# Altium schematic sheet STM8S_RF433_RELAY_LEARN_CODE_V1.SchDoc
size A4; SheetNumber: 1; SheetTotal: 1
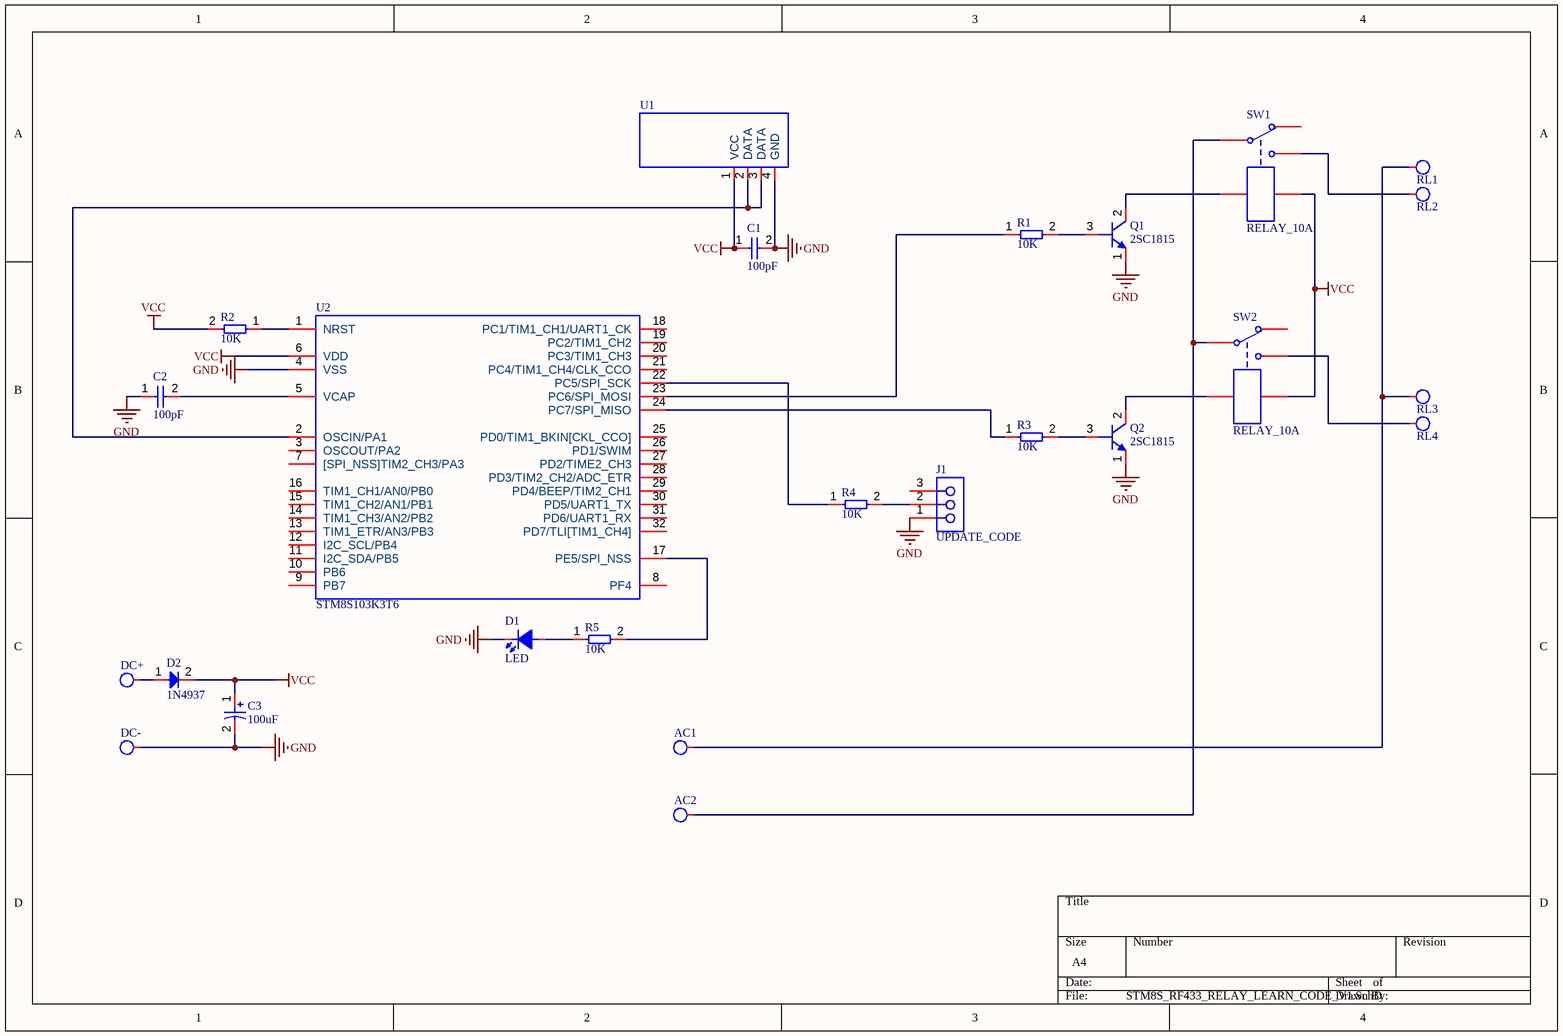
[diagram p0: STM8S_RF433_RELAY_LEARN_CODE_V1.SchDoc]

## Parts
AC1  SolderPoint  [SolderPoint]  (value not drawn)
AC2  SolderPoint  [SolderPoint]  (value not drawn)
C1  100pF  [CAP_Ceramic_Disc_2]
C2  100pF  [CAP_Ceramic_Disc_2]
C3  100uF  [CAP_RAD_2.5mm]
D1  LED  [LED_3MM_GREEN]
D2  1N4937  [DO-41]
DC+  SolderPoint  [SolderPoint]  (value not drawn)
DC-  SolderPoint  [SolderPoint]  (value not drawn)
J1  UPDATE_CODE  [Header 3x1 TH Pitch 2.54mm]
Q1  2SC1815  [TO-92]
Q2  2SC1815  [TO-92]
R1  10K  [RES-0.25W-H-MF]
R2  10K  [RES-0.25W-H-MF]
R3  10K  [RES-0.25W-H-MF]
R4  10K  [RES-0.25W-H-MF]
R5  10K  [RES-0.25W-H-MF]
RL1  AC  [SolderPoint]  (value not drawn)
RL2  AC  [SolderPoint]  (value not drawn)
RL3  AC  [SolderPoint]  (value not drawn)
RL4  AC  [SolderPoint]  (value not drawn)
SW1  RELAY_10A  [RELAY_10A_5PIN]
SW2  RELAY_10A  [RELAY_10A_5PIN]
U1  RF433_315_RECEVICE  [RF433_315_RECEVICE]  (value not drawn)
U2  STM8S103K3T6  [LQFP032_FPT-32P-M21]

## Nets
GND: C1.2 C2.1 C3.2 D1.2(K) DC-.1 J1.1 Q1.1(E) Q2.1(E) U1.4(GND) U2.4(VSS)
VCC: C1.1 C3.1 D2.2 R2.2 SW1.3 SW2.3 U1.1(VCC) U2.6(VDD)
NetAC1_1: AC1.1 RL1.1 RL3.1
NetAC2_1: AC2.1 SW1.2 SW2.2
NetC2_2: C2.2 U2.5(VCAP)
NetD1_1: D1.1(A) R5.1
NetD2_1: D2.1 DC+.1
NetJ1_2: J1.2 R4.2
NetQ1_2: Q1.2(C) SW1.1
NetQ1_3: Q1.3(B) R1.2
NetQ2_2: Q2.2(C) SW2.1
NetQ2_3: Q2.3(B) R3.2
NetR1_1: R1.1 U2.23(PC6/SPI_MOSI)
NetR2_1: R2.1 U2.1(NRST)
NetR3_1: R3.1 U2.24(PC7/SPI_MISO)
NetR4_1: R4.1 U2.22(PC5/SPI_SCK)
NetR5_2: R5.2 U2.17(PE5/SPI_NSS)
NetRL2_1: RL2.1 SW1.5
NetRL4_1: RL4.1 SW2.5
NetU1_2: U1.2(DATA) U1.3(DATA) U2.2(OSCIN/PA1)

Not connected (* = marked no-connect by the designer): J1 3; SW1 4; SW2 4; U2 3(OSCOUT/PA2) 7([SPI_NSS]TIM2_CH3/PA3) 8(PF4) 9(PB7) 10(PB6) 11(I2C_SDA/PB5) 12(I2C_SCL/PB4) 13(TIM1_ETR/AN3/PB3) 14(TIM1_CH3/AN2/PB2) 15(TIM1_CH2/AN1/PB1) 16(TIM1_CH1/AN0/PB0) 18(PC1/TIM1_CH1/UART1_CK) 19(PC2/TIM1_CH2) 20(PC3/TIM1_CH3) 21(PC4/TIM1_CH4/CLK_CCO) 25(PD0/TIM1_BKIN[CKL_CCO]) 26(PD1/SWIM) 27(PD2/TIME2_CH3) 28(PD3/TIM2_CH2/ADC_ETR) 29(PD4/BEEP/TIM2_CH1) 30(PD5/UART1_TX) 31(PD6/UART1_RX) 32(PD7/TLI[TIM1_CH4])

## Library data of the parts
C1 C2 = Capacitors(Disc)
C3 = Capacitor(Radian)
D1 = LED 3MM
J1 = Header 3x1 TH Pitch 2.54mm
Q1 Q2 = 2SC1815 (TO-92)
R1-R5 = Resistors THD
RL1-RL4 = SolderPoint
U1 = RF433_315